# Altium project Carte_Mere.PrjPcb (part 3 of 3)
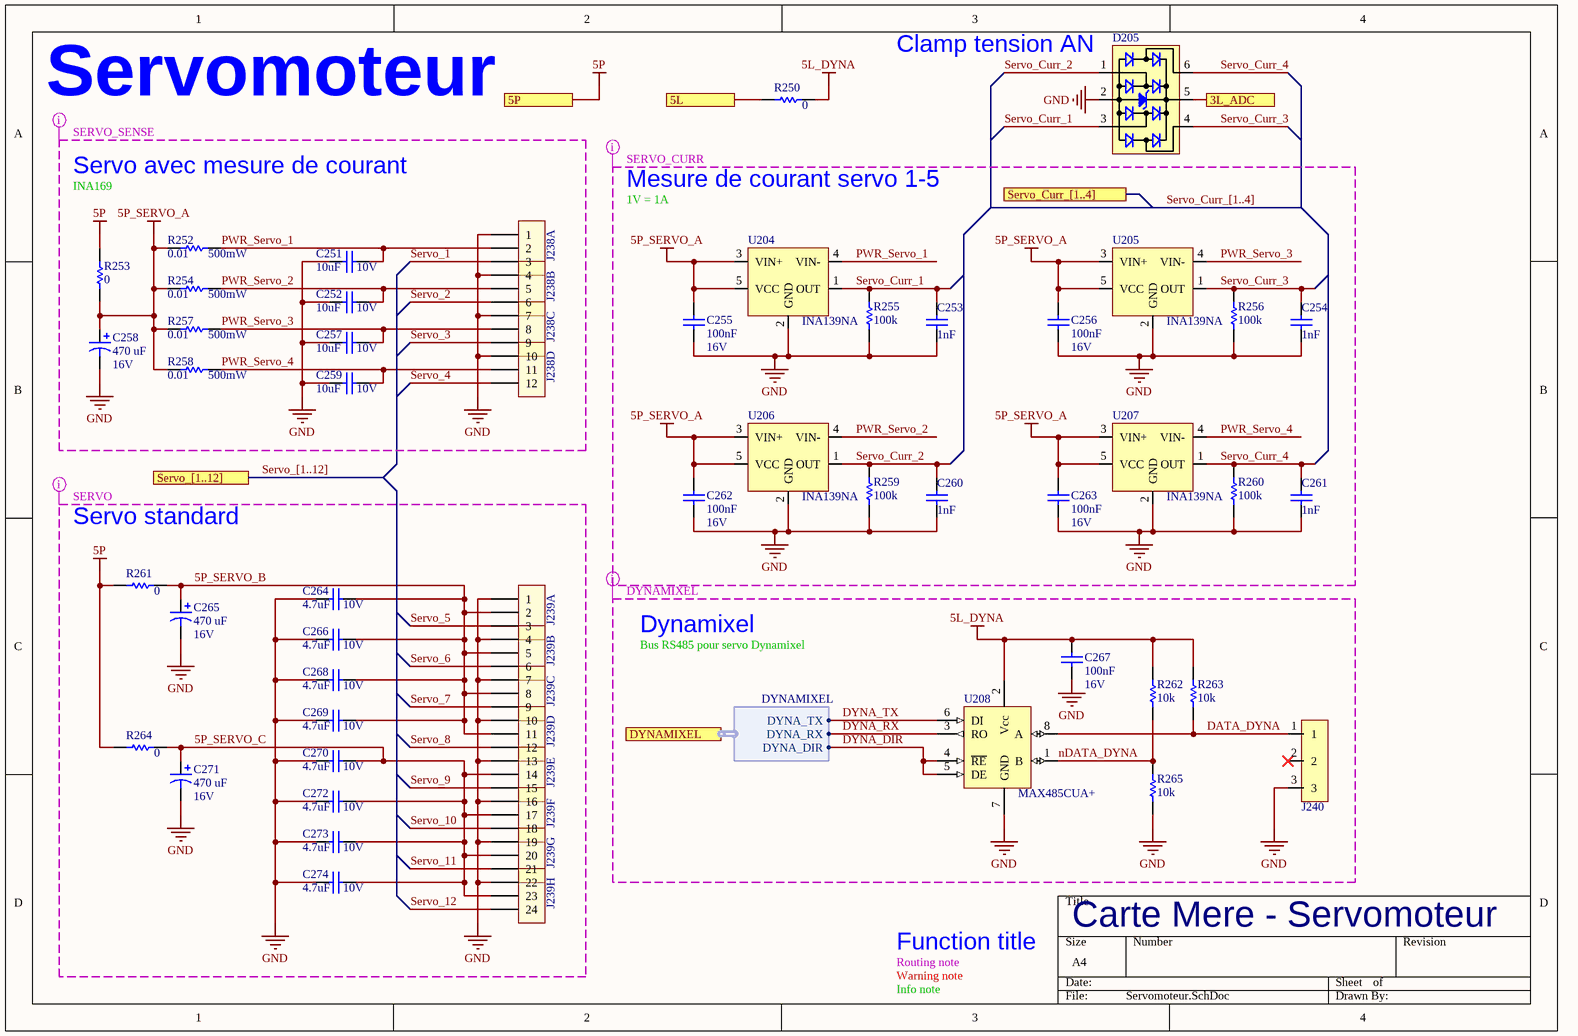
[diagram p8: Servomoteur.SchDoc]

## Nets that join several sheets
3L: Capteur (FB211.1), Interface_BUS (8 pins), Motorisation (R211.1), Power (C230.1 R249.2)
3L_ADC: Capteur (D200.5 D201.5 D202.5), Power (C227.1 J228.1 J232.1 R248.2), Servomoteur (D205.5)
5L: DE0_Nano (FB200.1), Nucleo (J223.2), Capteur (FB210.1), Interface_BUS (7 pins), Motorisation (FB201.1 FB202.1 FB203.1), Power (10 pins), Servomoteur (R250.1)
5P: Power (J226.1), Servomoteur (R253.1 R261.1 R264.1)
GND: TOP (H200.1 H201.1 H202.1 H203.1), DE0_Nano (8 pins), Nucleo (11 pins), Capteur (36 pins), Interface_BUS (30 pins), Motorisation (34 pins), Power (39 pins), Servomoteur (48 pins)
ADC_IN_1: DE0_Nano (R351.1), Power (J234.1)
ADC_IN_2: DE0_Nano (R352.2), Power (J236.1)
AU_STATUS: Nucleo (R293.2), Power (J229.8)
CAN_Rx: Nucleo (R302.1), Interface_BUS (U201.4)
CAN_Tx: Nucleo (R301.1), Interface_BUS (U201.1)
CaptTOR_1: DE0_Nano (R398.2), Nucleo (R372.2), Capteur (D200.4 J241.3)
CaptTOR_2: DE0_Nano (R396.1), Nucleo (R373.2), Capteur (D200.6 J241.4)
CaptTOR_3: DE0_Nano (R399.2), Capteur (D200.3 J241.5)
CaptTOR_4: DE0_Nano (R397.1), Capteur (D200.1 J241.6)
CaptTOR_5: DE0_Nano (R389.1), Capteur (D201.1 J241.7)
CaptTOR_6: DE0_Nano (R390.1), Capteur (D201.3 J241.8)
CaptTOR_7: DE0_Nano (R393.2), Capteur (D201.4 Q201.3 R271.1)
CaptTOR_8: DE0_Nano (R313.2), Capteur (D201.6 Q204.3 R283.1)
CaptTOR_9: DE0_Nano (R314.2), Capteur (D202.1 Q202.3 R272.1)
CaptTOR_10: DE0_Nano (R311.1), Capteur (D202.3 Q205.3 R284.1)
CaptTOR_11: DE0_Nano (R312.1), Capteur (D202.4 Q200.3 R268.1)
CaptTOR_12: DE0_Nano (R315.2), Capteur (D202.6 Q203.3 R280.1)
DYNA_DIR: Nucleo (R306.1), Servomoteur (U208.4 U208.5)
DYNA_RX: Nucleo (R305.1), Servomoteur (U208.3)
DYNA_TX: Nucleo (R304.2), Servomoteur (U208.6)
EXT_IO_1: DE0_Nano (R360.2), Nucleo (R357.2), Power (C231.1 J230.3)
EXT_IO_2: DE0_Nano (R361.2), Nucleo (R359.1), Power (C233.1 J230.6)
EXT_IO_3: DE0_Nano (R362.2), Nucleo (R356.2), Power (C235.1 J230.9)
EXT_IO_4: DE0_Nano (R366.1), Nucleo (R355.2), Power (C238.1 J230.12)
EXT_IO_5: DE0_Nano (R363.2), Nucleo (R354.2), Power (5 pins)
EXT_IO_6: DE0_Nano (R367.1), Nucleo (R358.1), Power (5 pins)
EXT_IO_7: DE0_Nano (R364.2), Power (C236.1 J233.8)
EXT_IO_8: DE0_Nano (R368.1), Power (C237.1 J233.9)
EXT_IO_9: DE0_Nano (R365.2), Power (C239.1 J233.11)
EXT_IO_10: DE0_Nano (R369.1), Power (C240.1 J233.12)
FPGA_Rx: DE0_Nano (R388.1), Interface_BUS (J206.9)
FPGA_Tx: DE0_Nano (R387.2), Interface_BUS (J206.8)
FT232_Rx: DE0_Nano (R405.2), Nucleo (R400.1), Interface_BUS (U200.5)
FT232_Tx: DE0_Nano (R404.1), Nucleo (R402.2), Interface_BUS (U200.1)
I2C1_SCL: DE0_Nano (R378.2), Nucleo (R375.1), Interface_BUS (J209.3 R208.1)
I2C1_SDA: DE0_Nano (R377.2), Nucleo (R374.1), Interface_BUS (J209.4 R209.1)
I2C2_SCL: DE0_Nano (R414.1), Interface_BUS (R201.1 R205.1)
I2C2_SDA: DE0_Nano (R417.2), Interface_BUS (R202.1 R206.1)
IRQ_FPGA: DE0_Nano (J203.10), Nucleo (R303.2)
LED_CLAVIER: Nucleo (R294.2), Power (J229.1)
MOT1_CS: DE0_Nano (R316.1), Motorisation (J213.7)
MOT1_DIR: DE0_Nano (R310.2), Motorisation (J213.4)
MOT1_PWM: DE0_Nano (R308.1), Motorisation (J213.3)
MOT2_CS: DE0_Nano (R317.2), Motorisation (J213.8)
MOT2_DIR: DE0_Nano (R309.2), Motorisation (J213.6)
MOT2_PWM: DE0_Nano (R307.1), Motorisation (J213.5)
NRST_NUCLEO: Nucleo (R376.2), Power (J229.3)
PROP_DIR1: DE0_Nano (R327.2), Nucleo (R318.2), Motorisation (J211.5)
PROP_DIR2: DE0_Nano (R326.1), Nucleo (R321.1), Motorisation (J211.6)
PROP_EN: DE0_Nano (R324.2), Nucleo (R319.1), Motorisation (J211.1)
PROP_S1-Rx: DE0_Nano (R325.2), Nucleo (R322.1), Motorisation (J211.3)
PROP_S2-Tx: DE0_Nano (R323.1), Nucleo (R320.2), Motorisation (J211.4)
QEI_M1_A: DE0_Nano (R334.1), Motorisation (R233.2 R247.2)
QEI_M1_B: DE0_Nano (R332.2), Motorisation (R235.2 R246.2)
QEI_M2_A: DE0_Nano (R333.1), Motorisation (R237.2 R245.2)
QEI_M2_B: DE0_Nano (R331.2), Motorisation (R239.2 R244.2)
QEI_P1_A: DE0_Nano (R347.2), Nucleo (R339.1), Motorisation (R232.2 R243.2)
QEI_P1_B: DE0_Nano (R344.1), Nucleo (R340.1), Motorisation (R234.2 R242.2)
QEI_P2_A: DE0_Nano (R348.2), Nucleo (R341.1), Motorisation (R236.2 R241.2)
QEI_P2_B: DE0_Nano (R343.1), Nucleo (R342.1), Motorisation (R238.2 R240.2)
Servo_1: DE0_Nano (R406.2), Servomoteur (J238.3)
Servo_2: DE0_Nano (R407.2), Servomoteur (J238.6)
Servo_3: DE0_Nano (R410.1), Servomoteur (J238.9)
Servo_4: DE0_Nano (R411.1), Servomoteur (J238.12)
Servo_5: DE0_Nano (R412.1), Servomoteur (J239.3)
Servo_6: DE0_Nano (R408.2), Servomoteur (J239.6)
Servo_7: DE0_Nano (R413.1), Servomoteur (J239.9)
Servo_8: DE0_Nano (R409.2), Servomoteur (J239.12)
Servo_9: DE0_Nano (R415.1), Servomoteur (J239.15)
Servo_10: DE0_Nano (R418.2), Servomoteur (J239.18)
Servo_11: DE0_Nano (R416.1), Servomoteur (J239.21)
Servo_12: DE0_Nano (R419.2), Servomoteur (J239.24)
SPI1_MISO: DE0_Nano (R329.1), Nucleo (J222.14)
SPI1_MOSI: DE0_Nano (R328.1), Nucleo (J222.16)
SPI1_SCK: DE0_Nano (R330.2), Nucleo (J222.12)
SPI2_CS_1: DE0_Nano (R346.1), Nucleo (R338.2), Interface_BUS (J208.6)
SPI2_MISO: DE0_Nano (R345.1), Nucleo (R336.2), Interface_BUS (J208.4)
SPI2_MOSI: DE0_Nano (R350.2), Nucleo (R335.2), Interface_BUS (J208.5)
SPI2_SCK: DE0_Nano (R349.2), Nucleo (R337.2), Interface_BUS (J208.3)
SPI3_CS_1: DE0_Nano (R385.2), Interface_BUS (J206.6)
SPI3_MISO: DE0_Nano (R386.2), Interface_BUS (J206.4 R205.2)
SPI3_MOSI: DE0_Nano (R384.1), Interface_BUS (J206.5 R206.2)
SPI3_SCK: DE0_Nano (R383.1), Interface_BUS (J206.3)
SSI_M1_CLK1: DE0_Nano (R421.2), Motorisation (R216.2 R222.2)
SSI_M1_CLK2: DE0_Nano (R423.1), Motorisation (R217.2 R221.2)
SSI_M1_DAT1: DE0_Nano (R425.2), Motorisation (R218.2 R220.2)
SSI_M1_DAT2: DE0_Nano (R424.1), Motorisation (R219.2 R223.2)
SSI_M2_CLK1: DE0_Nano (R420.2), Motorisation (R224.2 R230.2)
SSI_M2_CLK2: DE0_Nano (R422.1), Motorisation (R225.2 R229.2)
SSI_M2_DAT1: DE0_Nano (R370.1), Motorisation (R226.2 R228.2)
SSI_M2_DAT2: DE0_Nano (R371.1), Motorisation (R227.2 R231.2)
STM_Rx: Nucleo (R403.2), Interface_BUS (J206.12)
STM_Tx: Nucleo (R401.1), Interface_BUS (J206.11)
SW_1: DE0_Nano (R299.2), Nucleo (R295.2), Power (J229.5)
SW_2: DE0_Nano (R298.1), Nucleo (R296.2), Power (J229.6)
SW_3: DE0_Nano (R300.2), Power (J229.7)
SW_TIRETTE: DE0_Nano (R297.1), Nucleo (R292.1), Power (J229.4)
ToF_DS_1: DE0_Nano (R381.1), Interface_BUS (J209.5)
ToF_DS_2: DE0_Nano (R380.1), Interface_BUS (J209.6)
ToF_DS_3: DE0_Nano (R379.2), Interface_BUS (J209.7)
ToF_DS_4: DE0_Nano (R382.1), Interface_BUS (J209.8)

## Assembly variants
PROD: not fitted FB206 FB207 FB208 FB209 R205 R206 R269 R274 R275 R281 R286 R287 R323 R324 R325 R326 R327 R343 R344 R345 R346 R347 R348 R349 R350 R360 R361 R362 R363 R366 R367 R377 R378 R404 R405; alternate parts R270 -> RC0603FR-071K8L, R282 -> RC0603FR-071K8L, R277 -> RC0603FR-071K8L, R276 -> RC0603FR-071K8L, R289 -> RC0603FR-071K8L, R288 -> RC0603FR-071K8L